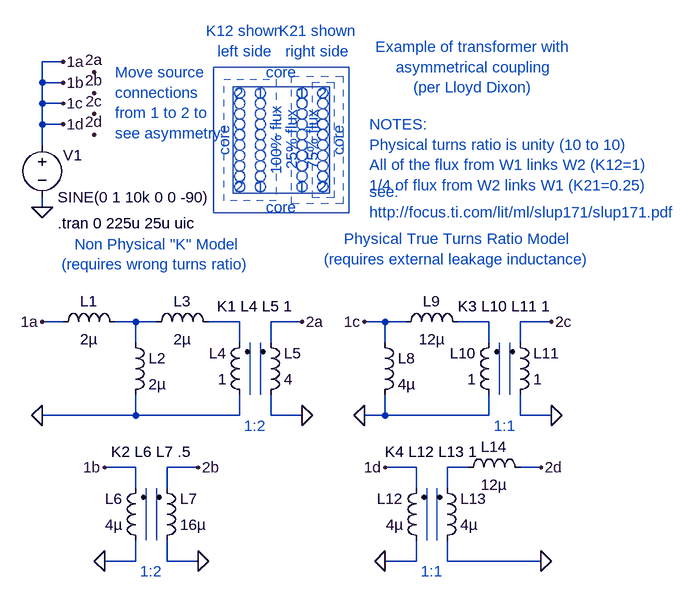
[diagram p0: schematic Asymmetrical-Transformer.asc]
Asymmetrical-Transformer.asc, the LTspice schematic file:
Version 4
SHEET 1 932 680
WIRE -16 -192 -48 -192
WIRE -48 -160 -48 -192
WIRE -16 -160 -48 -160
WIRE -48 -128 -48 -160
WIRE -16 -128 -48 -128
WIRE -48 -96 -48 -128
WIRE -16 -96 -48 -96
WIRE -48 -64 -48 -96
WIRE -48 32 -48 16
WIRE -16 208 -48 208
WIRE 96 208 64 208
WIRE 128 208 96 208
WIRE 256 208 208 208
WIRE 352 208 304 208
WIRE 480 208 448 208
WIRE 512 208 480 208
WIRE 640 208 592 208
WIRE 736 208 688 208
WIRE 96 240 96 208
WIRE 256 240 256 208
WIRE 304 240 304 208
WIRE 480 240 480 208
WIRE 640 240 640 208
WIRE 688 240 688 208
WIRE 96 352 96 320
WIRE 96 352 -48 352
WIRE 256 352 256 320
WIRE 256 352 96 352
WIRE 304 352 304 320
WIRE 352 352 304 352
WIRE 480 352 480 320
WIRE 480 352 448 352
WIRE 640 352 640 320
WIRE 640 352 480 352
WIRE 688 352 688 320
WIRE 736 352 688 352
WIRE 96 432 48 432
WIRE 192 432 144 432
WIRE 528 432 480 432
WIRE 608 432 576 432
WIRE 720 432 688 432
WIRE 96 464 96 432
WIRE 144 464 144 432
WIRE 528 464 528 432
WIRE 576 464 576 432
WIRE 96 576 96 544
WIRE 96 576 48 576
WIRE 144 576 144 544
WIRE 192 576 144 576
WIRE 528 576 528 544
WIRE 528 576 480 576
WIRE 576 576 576 544
WIRE 720 576 576 576
FLAG 352 352 0
FLAG -48 352 0
FLAG -48 208 1a
FLAG 352 208 2a
FLAG -48 32 0
FLAG 192 576 0
FLAG 192 432 2b
FLAG 48 432 1b
FLAG 48 576 0
FLAG 736 352 0
FLAG 736 208 2c
FLAG 448 208 1c
FLAG 448 352 0
FLAG 720 576 0
FLAG 720 432 2d
FLAG 480 432 1d
FLAG 480 576 0
FLAG -16 -192 1a
FLAG -16 -160 1b
FLAG -16 -128 1c
FLAG -16 -96 1d
FLAG 32 -176 2a
FLAG 32 -144 2b
FLAG 32 -112 2c
FLAG 32 -80 2d
SYMBOL ind -32 224 R270
WINDOW 0 32 56 VTop 0
WINDOW 3 5 56 VBottom 0
SYMATTR InstName L1
SYMATTR Value 2µ
SYMBOL ind 80 224 R0
SYMATTR InstName L2
SYMATTR Value 2µ
SYMBOL ind 112 224 R270
WINDOW 0 32 56 VTop 0
WINDOW 3 5 56 VBottom 0
SYMATTR InstName L3
SYMATTR Value 2µ
SYMBOL ind2 272 336 R180
WINDOW 0 36 80 Left 0
WINDOW 3 36 40 Left 0
SYMATTR InstName L4
SYMATTR Value 1
SYMATTR Type ind
SYMBOL ind2 288 336 M180
WINDOW 0 36 80 Left 0
WINDOW 3 36 40 Left 0
SYMATTR InstName L5
SYMATTR Value 4
SYMATTR Type ind
SYMATTR SpiceLine Rser=1u
SYMBOL voltage -48 -80 R0
WINDOW 0 32 32 Left 0
WINDOW 123 0 0 Left 0
WINDOW 39 0 0 Left 0
SYMATTR InstName V1
SYMATTR Value SINE(0 1 10k 0 0 -90)
SYMBOL ind2 112 560 R180
WINDOW 0 36 80 Left 0
WINDOW 3 36 40 Left 0
SYMATTR InstName L6
SYMATTR Value 4µ
SYMATTR Type ind
SYMATTR SpiceLine Rser=1u
SYMBOL ind2 128 560 M180
WINDOW 0 36 80 Left 0
WINDOW 3 36 40 Left 0
SYMATTR InstName L7
SYMATTR Value 16µ
SYMATTR Type ind
SYMATTR SpiceLine Rser=1u
SYMBOL ind 464 224 R0
SYMATTR InstName L8
SYMATTR Value 4µ
SYMBOL ind 496 224 R270
WINDOW 0 32 56 VTop 0
WINDOW 3 5 56 VBottom 0
SYMATTR InstName L9
SYMATTR Value 12µ
SYMBOL ind2 656 336 R180
WINDOW 0 36 80 Left 0
WINDOW 3 36 40 Left 0
SYMATTR InstName L10
SYMATTR Value 1
SYMATTR Type ind
SYMBOL ind2 672 336 M180
WINDOW 0 36 80 Left 0
WINDOW 3 36 40 Left 0
SYMATTR InstName L11
SYMATTR Value 1
SYMATTR Type ind
SYMATTR SpiceLine Rser=1u
SYMBOL ind2 544 560 R180
WINDOW 0 36 80 Left 0
WINDOW 3 36 40 Left 0
SYMATTR InstName L12
SYMATTR Value 4µ
SYMATTR Type ind
SYMATTR SpiceLine Rser=1u
SYMBOL ind2 560 560 M180
WINDOW 0 36 80 Left 0
WINDOW 3 36 40 Left 0
SYMATTR InstName L13
SYMATTR Value 4µ
SYMATTR Type ind
SYMBOL ind 592 448 R270
WINDOW 0 32 56 VTop 0
WINDOW 3 5 56 VBottom 0
SYMATTR InstName L14
SYMATTR Value 12µ
TEXT 280 184 Center 0 !K1 L4 L5 1
TEXT -24 56 Left 0 !.tran 0 225u 25u uic
TEXT 280 368 Center 0 ;1:2
TEXT 120 408 Center 0 !K2 L6 L7 .5
TEXT 120 592 Center 0 ;1:2
TEXT 664 184 Center 0 !K3 L10 L11 1
TEXT 664 368 Center 0 ;1:1
TEXT 552 408 Center 0 !K4 L12 L13 1
TEXT 552 592 Center 0 ;1:1
TEXT 256 -144 Center 0 ;2
TEXT 256 0 Center 0 ;2
TEXT 384 -144 Center 0 ;2
TEXT 384 0 Center 0 ;2
TEXT 288 -144 Center 0 ;1
TEXT 288 0 Center 0 ;1
TEXT 352 -144 Center 0 ;1
TEXT 352 0 Center 0 ;1
TEXT 232 -72 VCenter 0 ;core
TEXT 456 -96 Left 0 ;NOTES: \nPhysical turns ratio is unity (10 to 10)\nAll of the flux from W1 links W2 (K12=1)\n1/4 of flux from W2 links W1 (K21=0.25)
TEXT 368 -72 VCenter 0 ;75% flux
TEXT 336 -72 VCenter 0 ;25% flux
TEXT 312 -72 VCenter 0 ;100% flux
TEXT 408 -72 VCenter 0 ;core
TEXT 320 32 Center 0 ;core
TEXT 320 -176 Center 0 ;core
TEXT 264 -224 Center 0 ;K12 shown\nleft side
TEXT 376 -224 Center 0 ;K21 shown\nright side
TEXT 616 -184 Center 0 ;Example of transformer with\nasymmetrical coupling\n(per Lloyd Dixon)
TEXT 128 104 Center 0 ;Non Physical "K" Model\n(requires wrong turns ratio)
TEXT 592 96 Center 0 ;Physical True Turns Ratio Model\n(requires external leakage inductance)
TEXT 64 -176 Left 0 ;Move source \nconnections\nfrom 1 to 2 to\nsee asymmetry
TEXT 456 8 Left 0 ;see:\nhttp://focus.ti.com/lit/ml/slup171/slup171.pdf
LINE Normal 272 320 272 240
LINE Normal 288 320 288 240
LINE Normal 112 544 112 464
LINE Normal 128 544 128 464
LINE Normal 656 320 656 240
LINE Normal 672 320 672 240
LINE Normal 544 544 544 464
LINE Normal 560 544 560 464
RECTANGLE Normal 394 10 246 -154
RECTANGLE Normal 424 40 216 -184
RECTANGLE Normal 401 17 368 -161 2
RECTANGLE Normal 415 26 336 -170 2
RECTANGLE Normal 312 22 232 -165 2
CIRCLE Normal 360 -104 344 -120
CIRCLE Normal 360 -88 344 -104
CIRCLE Normal 360 -56 344 -72
CIRCLE Normal 360 -40 344 -56
CIRCLE Normal 360 -24 344 -40
CIRCLE Normal 360 -8 344 -24
CIRCLE Normal 360 8 344 -8
CIRCLE Normal 360 -136 344 -152
CIRCLE Normal 360 -120 344 -136
CIRCLE Normal 296 -104 280 -120
CIRCLE Normal 296 -88 280 -104
CIRCLE Normal 296 -56 280 -72
CIRCLE Normal 296 -40 280 -56
CIRCLE Normal 296 -24 280 -40
CIRCLE Normal 296 -8 280 -24
CIRCLE Normal 296 8 280 -8
CIRCLE Normal 296 -136 280 -152
CIRCLE Normal 296 -120 280 -136
CIRCLE Normal 264 -104 248 -120
CIRCLE Normal 264 -88 248 -104
CIRCLE Normal 264 -56 248 -72
CIRCLE Normal 264 -40 248 -56
CIRCLE Normal 264 -24 248 -40
CIRCLE Normal 264 -8 248 -24
CIRCLE Normal 264 8 248 -8
CIRCLE Normal 264 -136 248 -152
CIRCLE Normal 264 -120 248 -136
CIRCLE Normal 392 -104 376 -120
CIRCLE Normal 392 -88 376 -104
CIRCLE Normal 392 -56 376 -72
CIRCLE Normal 392 -40 376 -56
CIRCLE Normal 392 -24 376 -40
CIRCLE Normal 392 -8 376 -24
CIRCLE Normal 392 8 376 -8
CIRCLE Normal 392 -136 376 -152
CIRCLE Normal 392 -120 376 -136
CIRCLE Normal 264 -72 248 -88
CIRCLE Normal 296 -72 280 -88
CIRCLE Normal 360 -72 344 -88
CIRCLE Normal 392 -72 376 -88

The netlist it stands for:
* Asymmetrical-Transformer.asc
L1 1d N001 2µ
L2 N001 0 2µ
L3 N001 N002 2µ
L4 0 N002 1
L5 0 2a 4 Rser=1u
V1 1d 0 SINE(0 1 10k 0 0 -90)
L6 0 1d 4µ Rser=1u
L7 0 2b 16µ Rser=1u
L8 1d 0 4µ
L9 1d N003 12µ
L10 0 N003 1
L11 0 2c 1 Rser=1u
L12 0 1d 4µ Rser=1u
L13 0 N004 4µ
L14 N004 2d 12µ
K1 L4 L5 1
.tran 0 225u 25u uic
* 1:2
K2 L6 L7 .5
* 1:2
K3 L10 L11 1
* 1:1
K4 L12 L13 1
* 1:1
* 2
* 2
* 2
* 2
* 1
* 1
* 1
* 1
* core
* NOTES:
* Physical turns ratio is unity (10 to 10)
* All of the flux from W1 links W2 (K12=1)
* 1/4 of flux from W2 links W1 (K21=0.25)
* 75% flux
* 25% flux
* 100% flux
* core
* core
* core
* K12 shown
* left side
* K21 shown
* right side
* Example of transformer with
* asymmetrical coupling
* (per Lloyd Dixon)
* Non Physical "K" Model
* (requires wrong turns ratio)
* Physical True Turns Ratio Model
* (requires external leakage inductance)
* Move source
* connections
* from 1 to 2 to
* see asymmetry
* see:
* http://focus.ti.com/lit/ml/slup171/slup171.pdf
.backanno
.end